# Altium schematic sheet i2c pullups.SchDoc
size A4
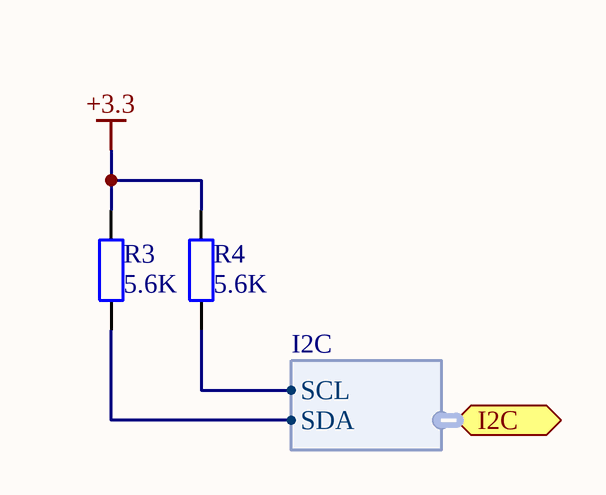
[diagram p0: i2c pullups.SchDoc]

## Parts
R3  value 5.6K  [R0603]  (hidden comment: Res2)
R4  value 5.6K  [R0603]  (hidden comment: Res2)

## Ports
I2C (harness I2C)

## Harnesses
I2C: SCL, SDA

## Nets
+3.3: R3.2 R4.2
NetR3_1: R3.1 ; port I2C.SDA
NetR4_1: R4.1 ; port I2C.SCL

## Library data of the parts
R3 R4 = Res2: Resistor; Published: 8-Jun-2000; LatestRevisionDate: 17-Jul-2002; LatestRevisionNote: Re-released for DXP Platform.; PackageReference: AXIAL-0.4; Publisher: Altium Limited; farnell: 2074283